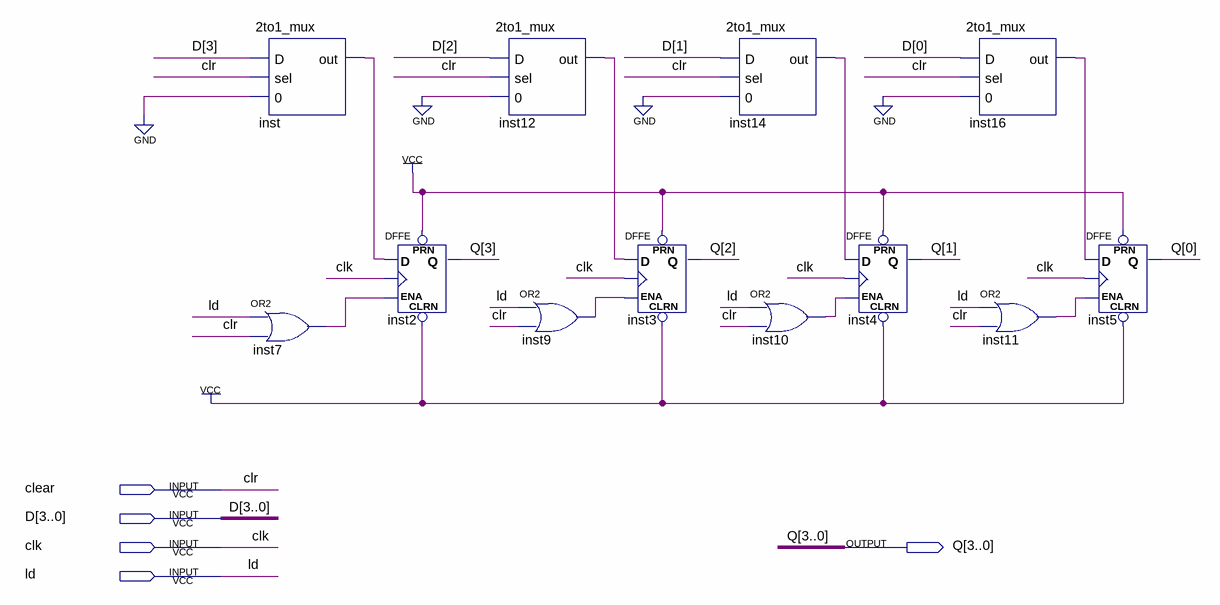
[diagram p0: schematic sheet]
// Quartus schematic 4bit_reg.bdf as structural Verilog: 12 symbols, 5 pins
module \4bit_reg  (
  input  clear,
  input  [3:0] D,
  input  clk,
  input  ld,
  output [3:0] Q
);

  wire inst7_out, inst9_out, inst10_out, inst11_out, inst12_out, inst14_out, inst16_out, inst_out;

  \2to1_mux  inst (.D(D[3]), .sel(clear), .\0 (1'b0), .out(inst_out));
  or inst7 (inst7_out, ld, clear);
  DFFE inst2 (.PRN(1'b1), .CLRN(1'b1), .D(inst_out), .CLK(clk), .ENA(inst7_out), .Q(Q[3]));
  \2to1_mux  inst12 (.D(D[2]), .sel(clear), .\0 (1'b0), .out(inst12_out));
  or inst9 (inst9_out, ld, clear);
  DFFE inst3 (.PRN(1'b1), .CLRN(1'b1), .D(inst12_out), .CLK(clk), .ENA(inst9_out), .Q(Q[2]));
  \2to1_mux  inst14 (.D(D[1]), .sel(clear), .\0 (1'b0), .out(inst14_out));
  or inst10 (inst10_out, ld, clear);
  DFFE inst4 (.PRN(1'b1), .CLRN(1'b1), .D(inst14_out), .CLK(clk), .ENA(inst10_out), .Q(Q[1]));
  \2to1_mux  inst16 (.D(D[0]), .sel(clear), .\0 (1'b0), .out(inst16_out));
  or inst11 (inst11_out, ld, clear);
  DFFE inst5 (.PRN(1'b1), .CLRN(1'b1), .D(inst16_out), .CLK(clk), .ENA(inst11_out), .Q(Q[0]));

  // Other names for the same wires on the sheet: clr = clear
endmodule
